# EAGLE schematic p0-001 (EAGLE 9.6.2)
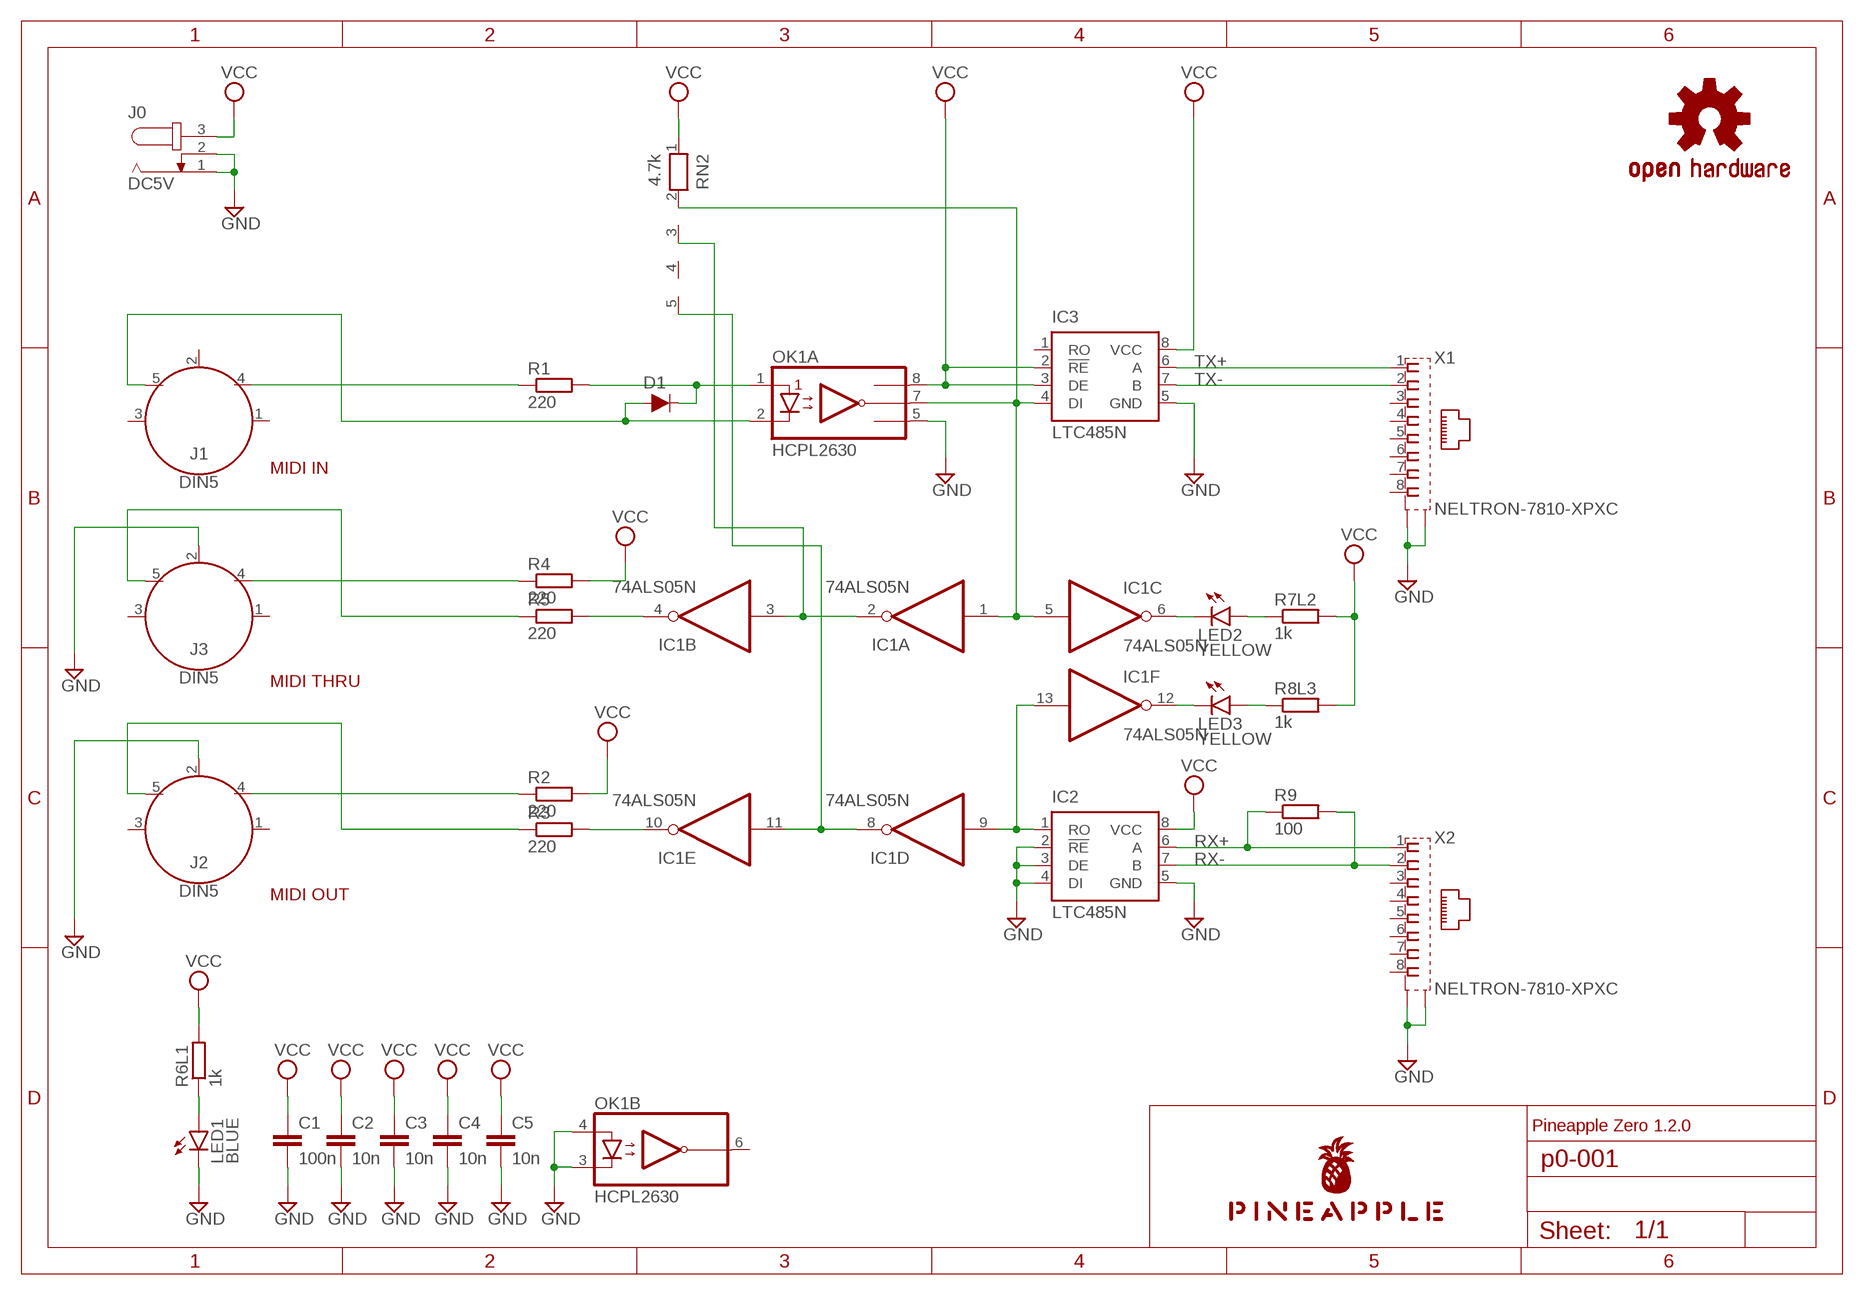
[diagram p0: schematic, sheet 1]

## Parts
C1  100n  C-EU025-024X044  [C025-024X044]
C2  10n  C-EU025-024X044  [C025-024X044]
C3  10n  C-EU025-024X044  [C025-024X044]
C4  10n  C-EU025-024X044  [C025-024X044]
C5  10n  C-EU025-024X044  [C025-024X044]
D1  DIODE-1N4148  [DIODE-1N4148]
IC1  74ALS05N  [DIL14]
IC2  LTC485N  [DIL08]
IC3  LTC485N  [DIL08]
J0  DC5V  JACK-PLUG0  [SPC4077]
J1  DIN5  [DIN5-RA-PTH]
J2  DIN5  [DIN5-RA-PTH]
J3  DIN5  [DIN5-RA-PTH]
LED1  BLUE  LED3MM  [LED3MM]
LED2  YELLOW  LED3MM  [LED3MM]
LED3  YELLOW  LED3MM  [LED3MM]
LOGO1  OSHW-LOGOS-COPPER  [OSHW-LOGO-S_COPPER]
OK1  HCPL2630  [DIL08]
R1  220  R-EU_0204/5  [0204/5]
R2  220  R-EU_0204/5  [0204/5]
R3  220  R-EU_0204/5  [0204/5]
R4  220  R-EU_0204/5  [0204/5]
R5  220  R-EU_0204/5  [0204/5]
R6L1  1k  R-EU_0204/5  [0204/5]
R7L2  1k  R-EU_0204/5  [0204/5]
R8L3  1k  R-EU_0204/5  [0204/5]
R9  100  R-EU_0204/5  [0204/5]
RN2  4.7k  RN04  [RN-5]
U$1  PINEAPPLE450  [PINEAPPLE450]
X1  NELTRON-7810-XPXC  [NELTRON-7810-XPXC-FOOTPRINT]
X2  NELTRON-7810-XPXC  [NELTRON-7810-XPXC-FOOTPRINT]

## Nets
GND [gnd]: C1.2 C2.2 C3.2 C4.2 C5.2 IC2.2(!RE) IC2.3(DE) IC2.4(DI) IC2.5(GND) IC3.5(GND) J0.1 J0.2 J2.2 J3.2 LED1.K(C) OK1.3(B:C2) OK1.4(B:A2) OK1.5(A:GND) X1.S1 X1.S2 X2.S1 X2.S2
MIDIIN: D1.C OK1.1(A:A1) R1.2
MIDIOUT: IC1.10(E:O) R3.2
MIDITHRU: IC1.4(B:O) R5.2
MIRTN: D1.A J1.5 OK1.2(A:C1)
MISND: J1.4 R1.1
MORTN: J2.5 R3.1
MOSND: J2.4 R2.1
MTRTN: J3.5 R5.1
MTSND: J3.4 R4.1
N$1: IC1.6(C:O) LED2.K(C)
N$2: LED3.A R8L3.1
N$3: IC1.12(F:O) LED3.K(C)
N$4: LED1.A R6L1.1
N$5: LED2.A R7L2.1
NMIDIOUT: IC1.8(D:O) IC1.11(E:I) RN2.5
NMIDITHRU: IC1.2(A:O) IC1.3(B:I) RN2.3
RX: IC1.9(D:I) IC1.13(F:I) IC2.1(RO)
RX+: IC2.6(A) R9.1 X2.1
RX-: IC2.7(B) R9.2 X2.2
TX: IC1.1(A:I) IC1.5(C:I) IC3.4(DI) OK1.7(A:VO1) RN2.2
TX+: IC3.6(A) X1.1
TX-: IC3.7(B) X1.2
VCC [pwr]: C1.1 C2.1 C3.1 C4.1 C5.1 IC2.8(VCC) IC3.2(!RE) IC3.3(DE) IC3.8(VCC) J0.3 OK1.8(A:VCC) R2.2 R4.2 R6L1.2 R7L2.2 R8L3.2 RN2.1
Unconnected: IC3.1(RO) J1.1 J1.2 J1.3 J2.1 J2.3 J3.1 J3.3 OK1.6(B:VO2) RN2.4 X1.3 X1.4 X1.5 X1.6 X1.7 X1.8 X2.3 X2.4 X2.5 X2.6 X2.7 X2.8

## Notes on the sheet
- MIDI IN
- MIDI THRU
- MIDI OUT
- Pineapple Zero 1.2.0

## Power pins joined to a net without a drawn wire
GND: IC1.7(P:GND)
VCC: IC1.14(P:VCC)

## Library data of the parts
C1-C5 = rcl:C-EU: CAPACITOR, European symbol; SPICEPREFIX: C
D1 = SparkFun-DiscreteSemi:DIODE: Diode These are standard reverse protection diodes and small signal diodes. SparkFun Products: SparkFun SparkPunk Sound Kit <https://www.sparkfun.com/products/11177> SparkFun ESP8266 Thing <https://www.sparkfun.com/products/13231>; PROD_ID: DIO-08378; VALUE: 200mA/100V/1V
IC1 = 74xx-us:74*05: Hex INVERTER, open collector
IC2 IC3 = linear-technology:LTC485: Low Power RS485 Interface Transceiver Source: http://www.linear.com/pc/downloadDocument.do?navId=H0,C1,C1007,C1017,P2064,D1718; OC_FARNELL: unknown; OC_NEWARK: unknown
J0 = con-jack:JACK-PLUG: DC POWER JACK Power Jack, DC, Right Angle, Through Hole, Rated 5A at 16VDC, PC Terminals Distributor: Farnell (www.Farnell.de) Drawing: 84N1161.pdf / 84N1162.pdf Manufacturer: SPC Technology (www.spctechnology.com) Type: SPC4077 / SPC 4078; OC_FARNELL: unknown; OC_NEWARK: unknown
J1-J3 = SparkFun-Connectors:DIN5: DIN5 Connector - Female Right Angle (frequently used as a MIDI Jack connector) This type of connector and cable is frequently used for transmitting midi data (musical instrument digital interface). It is what you usually see on a keyboard or set of electronic drums. Learn more here <https://en.wikipedia.org/wiki/MIDI>. For more information on the pinout and electrical specifications of MIDI communications, please see the following resource: https://www.midi.org/specifications/item/midi-din-electrical-specification Here is the connector we sell at SparkFun: MIDI Connector - Female Right Angle <https://www.sparkfun.com/products/9536> (PRT-09536) Datasheet <hhttp://www.sparkfun.com/datasheets/Prototyping/Connectors/MIDI-RA.pdf> It is used on this SparkFun product: SparkFun MIDI Shield <https://www.sparkfun.com/products/12898> (DEV-12898); PROD_ID: CONN-09481
LED1-LED3 = led:LED: LED OSRAM: - CHIPLED LG R971, LG N971, LY N971, LG Q971, LY Q971, LO R971, LY R971 LH N974, LH R974 LS Q976, LO Q976, LY Q976 LO Q996 - Hyper CHIPLED LW Q18S LB Q993, LB Q99A, LB R99A - SideLED LS A670, LO A670, LY A670, LG A670, LP A670 LB A673, LV A673, LT A673, LW A673 LH A674 LY A675 LS A676, LA A676, LO A676, LY A676, LW A676 LS A679, LY A679, LG A679 - Hyper Micro SIDELED® LS Y876, LA Y876, LO Y876, LY Y876 LT Y87S - SmartLED LW L88C, LW L88S LB L89C, LB L89S, LG L890 LS L89K, LO L89K, LY L89K LS L896, LA L896, LO L896, LY L896 - TOPLED LS T670, LO T670, LY T670, LG T670, LP T670 LSG T670, LSP T670, LSY T670, LOP T670, LYG T670 LG T671, LOG T671, LSG T671 LB T673, LV T673, LT T673, LW T673 LH T674 LS T676, LA T676, LO T676, LY T676, LB T676, LH T676, LSB T676, LW T676 LB T67C, LV T67C, LT T67C, LS T67K, LO T67K, LY T67K, LW E67C LS E67B, LA E67B, LO E67B, LY E67B, LB E67C, LV E67C, LT E67C LW T67C LS T679, LY T679, LG T679 LS T770, LO T770, LY T770, LG T770, LP T770 LB T773, LV T773, LT T773, LW T773 LH T774 LS E675, LA E675, LY E675, LS T675 LS T776, LA T776, LO T776, LY T776, LB T776 LHGB T686 LT T68C, LB T68C - Hyper Mini TOPLED® LB M676 - Mini TOPLED Santana® LG M470 LS M47K, LO M47K, LY M47K Source: http://www.osram.convergy.de LUXEON: - LUMILED® LXK2-PW12-R00, LXK2-PW12-S00, LXK2-PW14-U00, LXK2-PW14-V00 LXK2-PM12-R00, LXK2-PM12-S00, LXK2-PM14-U00 LXK2-PE12-Q00, LXK2-PE12-R00, LXK2-PE12-S00, LXK2-PE14-T00, LXK2-PE14-U00 LXK2-PB12-K00, LXK2-PB12-L00, LXK2-PB12-M00, LXK2-PB14-N00, LXK2-PB14-P00, LXK2-PB14-Q00 LXK2-PR12-L00, LXK2-PR12-M00, LXK2-PR14-Q00, LXK2-PR14-R00 LXK2-PD12-Q00, LXK2-PD12-R00, LXK2-PD12-S00 LXK2-PH12-R00, LXK2-PH12-S00 LXK2-PL12-P00, LXK2-PL12-Q00, LXK2-PL12-R00 Source: www.luxeon.com KINGBRIGHT: KA-3528ASYC Source: www.kingbright.com
LOGO1 = SparkFun-Aesthetics:OSHW-LOGO: Open-Source Hardware (OSHW) Logo This logo indicates the piece of hardware it is found on incorporates a OSHW license and/or adheres to the definition of open source hardware found here: http://freedomdefined.org/OSHW
OK1 = optocoupler:HCPL2630: HEWLETT PACKARD OPTO COUPLER; MF: AGILENT TECHNOLOGIES; MPN: HCPL-2630-000E; OC_FARNELL: 9994904; OC_NEWARK: 88H7813
R1-R5 R6L1 R7L2 R8L3 R9 = rcl:R-EU_: RESISTOR, European symbol; SPICEPREFIX: R
RN2 = resistor-net:RN04: RESISTOR NETWORK; OC_FARNELL: unknown; OC_NEWARK: unknown
U$1 = pineapple:PINEAPPLE450
X1 X2 = con-rj45:NELTRON-7810-XPXC: Mod. Jack, Right Angle, 8 posiotion, 8 contatcs RJ45 Source: GLX-S-88M.pdf

## Net classes
0 default: width 0.152 mm, drill 0.152 mm, clearance 0.152 mm
1 pwr: width 0.305 mm, drill 0.152 mm, clearance 0.152 mm
2 gnd: width 0.305 mm, drill 0.152 mm, clearance 0.152 mm